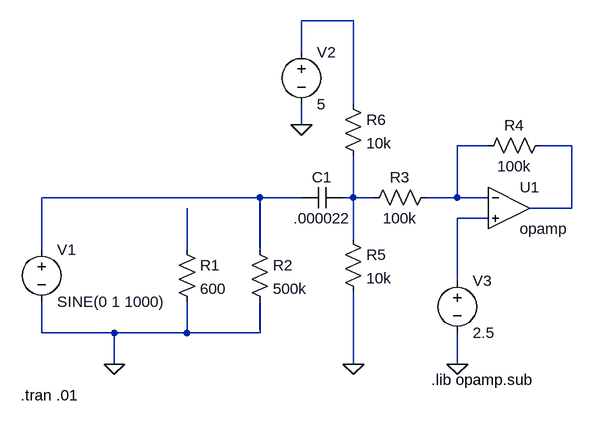
[diagram p0: schematic op-amp_input.asc]
op-amp_input.asc, the LTspice schematic file:
Version 4
SHEET 1 880 680
WIRE 64 -144 -16 -144
WIRE -16 -96 -16 -144
WIRE 64 -16 64 -144
WIRE -16 16 -16 -16
WIRE 272 48 224 48
WIRE 400 48 352 48
WIRE -80 128 -416 128
WIRE -16 128 -80 128
WIRE 64 128 64 64
WIRE 64 128 48 128
WIRE 96 128 64 128
WIRE 224 128 224 48
WIRE 224 128 176 128
WIRE 272 128 224 128
WIRE 400 144 400 48
WIRE 400 144 336 144
WIRE 272 160 224 160
WIRE 64 192 64 128
WIRE -416 208 -416 128
WIRE -192 208 -192 144
WIRE -80 208 -80 128
WIRE 224 256 224 160
WIRE -416 336 -416 288
WIRE -304 336 -416 336
WIRE -192 336 -192 288
WIRE -192 336 -304 336
WIRE -80 336 -80 288
WIRE -80 336 -192 336
WIRE -304 384 -304 336
WIRE 64 384 64 272
WIRE 224 384 224 336
FLAG -304 384 0
FLAG 64 384 0
FLAG -16 16 0
FLAG 224 384 0
SYMBOL Opamps\\opamp 304 80 R0
SYMATTR InstName U1
SYMBOL res -208 192 R0
SYMATTR InstName R1
SYMATTR Value 600
SYMBOL res -96 192 R0
SYMATTR InstName R2
SYMATTR Value 500k
SYMBOL voltage -416 192 R0
WINDOW 123 0 0 Left 2
WINDOW 39 0 0 Left 2
SYMATTR InstName V1
SYMATTR Value SINE(0 1 1000)
SYMBOL res 80 144 R270
WINDOW 0 32 56 VTop 2
WINDOW 3 0 56 VBottom 2
SYMATTR InstName R3
SYMATTR Value 100k
SYMBOL res 256 64 R270
WINDOW 0 32 56 VTop 2
WINDOW 3 0 56 VBottom 2
SYMATTR InstName R4
SYMATTR Value 100k
SYMBOL cap 48 112 R90
WINDOW 0 0 32 VBottom 2
WINDOW 3 32 32 VTop 2
SYMATTR InstName C1
SYMATTR Value .000022
SYMBOL res 48 176 R0
SYMATTR InstName R5
SYMATTR Value 10k
SYMBOL res 48 -32 R0
SYMATTR InstName R6
SYMATTR Value 10k
SYMBOL voltage -16 -112 R0
WINDOW 123 0 0 Left 2
WINDOW 39 0 0 Left 2
SYMATTR InstName V2
SYMATTR Value 5
SYMBOL voltage 224 240 R0
WINDOW 123 0 0 Left 2
WINDOW 39 0 0 Left 2
SYMATTR InstName V3
SYMATTR Value 2.5
TEXT 184 408 Left 2 !.lib opamp.sub
TEXT -448 432 Left 2 !.tran .01

The netlist it stands for:
* op-amp_input.asc
XU1 N002 N006 N003 opamp Aol=100K GBW=10Meg  ; pins invin noninvin out
R1 N007 0 600
R2 N004 0 500k
V1 N004 0 SINE(0 1 1000)
R3 N005 N002 100k
R4 N002 N003 100k
C1 N005 N004 .000022
R5 N005 0 10k
R6 N001 N005 10k
V2 N001 0 5
V3 N006 0 2.5
.lib opamp.sub
.tran .01
.backanno
.end